# Altium schematic sheet current_signal_adaptation_2.SchDoc
size A4; SheetNumber: 4; SheetTotal: 12
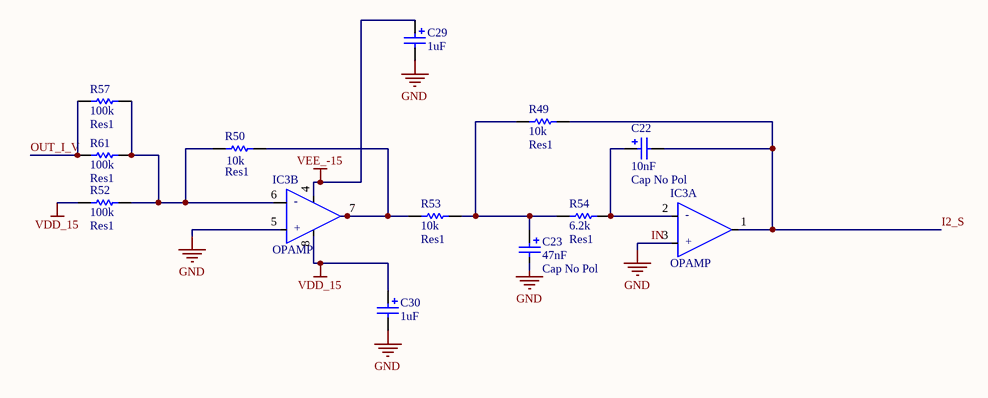
[diagram p0: current_signal_adaptation_2.SchDoc]

## Parts
C22  Cap No Pol  value 10nF  [RAD-0.1]
C23  Cap No Pol  value 47nF  [RAD-0.1]
C29  value 1uF  [RAD-0.1]  (hidden comment: Cap No Pol)
C30  value 1uF  [RAD-0.1]  (hidden comment: Cap No Pol)
IC3  OPAMP  [DIP-8]  (parts A,B of 2)
R49  Res1  value 10k  [AXIAL-0.4]
R50  Res1  value 10k  [AXIAL-0.4]
R52  Res1  value 100k  [AXIAL-0.4]
R53  Res1  value 10k  [AXIAL-0.4]
R54  Res1  value 6.2k  [AXIAL-0.4]
R57  Res1  value 100k  [AXIAL-0.4]
R61  Res1  value 100k  [AXIAL-0.4]

## Nets
IN: C23.2 C29.2 C30.2 IC3.3(IN_A_+) IC3.5(IN_B_+)  [also labelled GND]
VDD_15: C30.1 IC3.8(V+) R52.1
VEE_-15: C29.1 IC3.4(-V)
I2_S: C22.2 IC3.1(OUT_A) R49.2
OUT_I_V: R57.1 R61.1
NetC22_1: C22.1 IC3.2(IN_A_-) R54.2
NetC23_1: C23.1 R49.1 R53.2 R54.1
NetIC3_7: IC3.7(OUT_B) R50.2 R53.1
NetR50_1: R50.1 R52.2 R57.2 R61.2

Not connected (* = marked no-connect by the designer): IC3 6(IN_B_-)

## Notes on the sheet
- (in symbol ADTL082, part A) -; +
- (in symbol ADTL082, part B) -; +

## Library data of the parts
C22 C23 C29 C30 = Cap No Pol: Polarized Capacitor (Radial); Published: 8-Jun-2000; LatestRevisionDate: 17-Jul-2002; LatestRevisionNote: Re-released for DXP Platform.; PackageReference: RB7.6-15; Publisher: Altium Limited; PackageDescription: Polarized Capacitor (Radial); 2 Leads
IC3 = ADTL082
R49 R50 R52-R54 R57 R61 = Res1: Resistor; Published: 8-Jun-2000; LatestRevisionDate: 17-Jul-2002; LatestRevisionNote: Re-released for DXP Platform.; PackageReference: AXIAL-0.3; Publisher: Altium Limited; PackageDescription: Axial Device, Thru-Hole; 2 Leads; 0.3 in Pin Spacing